# Altium schematic sheet ESP32-S3.SchDoc
size A4; SheetNumber: 2; SheetTotal: 5
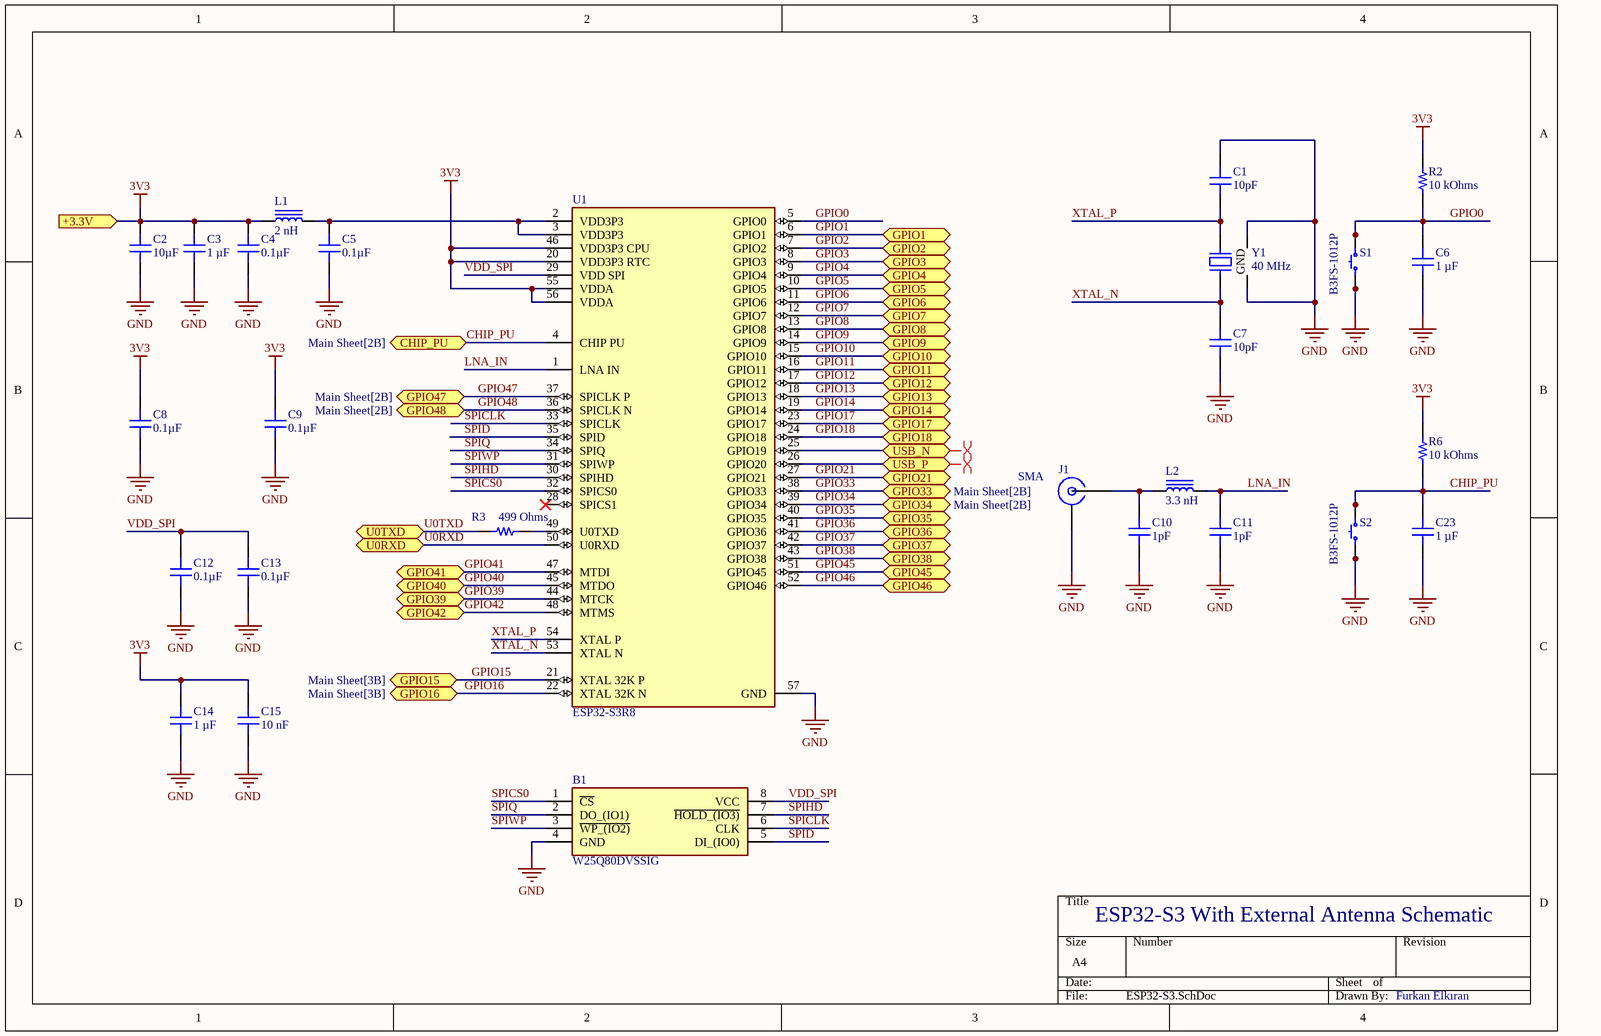
[diagram p0: ESP32-S3.SchDoc]

## Parts
B1  W25Q80DVSSIG  [SOIC127P790X216-8N]
C1  10pF  [CAP 0402_1005]
C2  10µF  [CAP 0402_1005]
C3  1 µF  [CAP 0402_1005]
C4  0.1µF  [CAP 0402_1005]
C5  0.1µF  [CAP 0402_1005]
C6  1 µF  [CAP 0402_1005]
C7  10pF  [CAP 0402_1005]
C8  0.1µF  [CAP 0402_1005]
C9  0.1µF  [CAP 0402_1005]
C10  1pF  [CAP 0402_1005]
C11  1pF  [CAP 0402_1005]
C12  0.1µF  [CAP 0402_1005]
C13  0.1µF  [CAP 0402_1005]
C14  1 µF  [CAP 0402_1005]
C15  Capacitance: 10 nF  [CAP 0402_1005]  (hidden comment: 1 µF)
C23  1 µF  [CAP 0402_1005]
J1  Connector Style: SMA  [MOLEX SD-73100-0114]  (hidden comment: 0731000114)
L1  2 nH  [IND 0402_1005]
L2  3.3 nH  [Murata LQG15 0402]
R2  10 kOhms  [RES 0402_1005]
R3  499 Ohms  [RES 0402_1005]
R6  10 kOhms  [RES 0402_1005]
S1  B3FS-1012P  [OMRON B3FS-1012P]
S2  B3FS-1012P  [OMRON B3FS-1012P]
U1  ESP32-S3R8  [FP-ESP32-S3R8-IPC_A]
Y1  40 MHz  [NDK NX3225SA]

## Ports
+3.3V (in, see Main Sheet[2A], Power[4B], SSD1306[3C]), CHIP_PU (bidir, see Main Sheet[2B]), GPIO1 (bidir, see Main Sheet[3A]), GPIO2 (bidir, see Main Sheet[3A]), GPIO3 (bidir, see Main Sheet[3B]), GPIO4 (bidir, see Main Sheet[3B]), GPIO5 (bidir, see Main Sheet[3B]), GPIO6 (bidir, see Main Sheet[3B]), GPIO7 (bidir, see Main Sheet[3B]), GPIO8 (bidir, see Main Sheet[3B]), GPIO9 (bidir, see Main Sheet[3B]), GPIO10 (bidir, see Main Sheet[3B]), GPIO11 (bidir, see Main Sheet[3B]), GPIO12 (bidir, see Main Sheet[3B]), GPIO13 (bidir, see Main Sheet[3B]), GPIO14 (bidir, see Main Sheet[3B]), GPIO15 (bidir, see Main Sheet[3B]), GPIO16 (bidir, see Main Sheet[3B]), GPIO17 (bidir, see Main Sheet[3B]), GPIO18 (bidir, see Main Sheet[3B]), GPIO21 (bidir, see Main Sheet[3B]), GPIO33 (bidir, see Main Sheet[2B]), GPIO34 (bidir, see Main Sheet[2B]), GPIO35 (bidir, see Main Sheet[2B]), GPIO36 (bidir, see Main Sheet[2B]), GPIO37 (bidir, see Main Sheet[2B]), GPIO38 (bidir, see Main Sheet[2B]), GPIO39 (bidir, see Main Sheet[2B]), GPIO40 (bidir, see Main Sheet[2B]), GPIO41 (bidir, see Main Sheet[2B]), GPIO42 (bidir, see Main Sheet[2B]), GPIO45 (bidir, see Main Sheet[2B]), GPIO46 (bidir, see Main Sheet[2B]), GPIO47 (bidir, see Main Sheet[2B]), GPIO48 (bidir, see Main Sheet[2B]), U0RXD (bidir, see Main Sheet[2B]), U0TXD (bidir, see Main Sheet[2B]), USB_N (bidir, see Main Sheet[2B], USB-C[3B]), USB_P (bidir, see Main Sheet[2B], USB-C[3B])

## Nets
3V3: C2.2 C3.2 C4.2 C8.2 C9.2 C14.2 C15.2 L1.1 R2.2 R6.2 U1.20(VDD3P3_RTC) U1.46(VDD3P3_CPU) U1.55(VDDA) U1.56(VDDA) ; port +3.3V
GND: B1.4(GND) C1.2 C2.1 C3.1 C4.1 C5.1 C6.1 C7.1 C8.1 C9.1 C10.1 C11.1 C12.1 C13.1 C14.1 C15.1 C23.1 J1.G(GND) S1.1 S1.2 S2.1 S2.2 U1.57(GND) Y1.2(GND) Y1.4(GND)
CHIP_PU: C23.2 R6.1 S2.3 S2.4 U1.4(CHIP_PU) ; port CHIP_PU
GPIO0: C6.2 R2.1 S1.3 S1.4 U1.5(GPIO0)
GPIO1: U1.6(GPIO1) ; port GPIO1
GPIO2: U1.7(GPIO2) ; port GPIO2
GPIO3: U1.8(GPIO3) ; port GPIO3
GPIO4: U1.9(GPIO4) ; port GPIO4
GPIO5: U1.10(GPIO5) ; port GPIO5
GPIO6: U1.11(GPIO6) ; port GPIO6
GPIO7: U1.12(GPIO7) ; port GPIO7
GPIO8: U1.13(GPIO8) ; port GPIO8
GPIO9: U1.14(GPIO9) ; port GPIO9
GPIO10: U1.15(GPIO10) ; port GPIO10
GPIO11: U1.16(GPIO11) ; port GPIO11
GPIO12: U1.17(GPIO12) ; port GPIO12
GPIO13: U1.18(GPIO13) ; port GPIO13
GPIO14: U1.19(GPIO14) ; port GPIO14
GPIO15: U1.21(XTAL_32K_P) ; port GPIO15
GPIO16: U1.22(XTAL_32K_N) ; port GPIO16
GPIO17: U1.23(GPIO17) ; port GPIO17
GPIO18: U1.24(GPIO18) ; port GPIO18
GPIO21: U1.27(GPIO21) ; port GPIO21
GPIO33: U1.38(GPIO33) ; port GPIO33
GPIO34: U1.39(GPIO34) ; port GPIO34
GPIO35: U1.40(GPIO35) ; port GPIO35
GPIO36: U1.41(GPIO36) ; port GPIO36
GPIO37: U1.42(GPIO37) ; port GPIO37
GPIO38: U1.43(GPIO38) ; port GPIO38
GPIO39: U1.44(MTCK) ; port GPIO39
GPIO40: U1.45(MTDO) ; port GPIO40
GPIO41: U1.47(MTDI) ; port GPIO41
GPIO42: U1.48(MTMS) ; port GPIO42
GPIO45: U1.51(GPIO45) ; port GPIO45
GPIO46: U1.52(GPIO46) ; port GPIO46
GPIO47: U1.37(SPICLK_P) ; port GPIO47
GPIO48: U1.36(SPICLK_N) ; port GPIO48
LNA_IN: C11.2 L2.2 U1.1(LNA_IN)
SPICLK: B1.6(CLK) U1.33(SPICLK)
SPICS0: B1.1(~{CS}) U1.32(SPICS0)
SPID: B1.5(DI_(IO0)) U1.35(SPID)
SPIHD: B1.7(~{HOLD_(IO3)}) U1.30(SPIHD)
SPIQ: B1.2(DO_(IO1)) U1.34(SPIQ)
SPIWP: B1.3(~{WP_(IO2)}) U1.31(SPIWP)
U0RXD: U1.50(U0RXD) ; port U0RXD
U0TXD: R3.1 ; port U0TXD
USB_N: U1.25(GPIO19) ; port USB_N
USB_P: U1.26(GPIO20) ; port USB_P
VDD_SPI: B1.8(VCC) C12.2 C13.2 U1.29(VDD_SPI)
XTAL_N: C7.2 U1.53(XTAL_N) Y1.1
XTAL_P: C1.1 U1.54(XTAL_P) Y1.3
NetC5_2: C5.2 L1.2 U1.2(VDD3P3) U1.3(VDD3P3)
NetC10_2: C10.2 J1.S(SIGNAL) L2.1
NetR3_2: R3.2 U1.49(U0TXD)

Not connected (* = marked no-connect by the designer): U1 28(SPICS1)*

## Layout directives
differential pair: USB_N, USB_P

## Notes on the sheet
- ESP32-S3 With External Antenna Schematic
- Furkan Elkıran

## Library data of the parts
B1 = W25Q80DVSSIG: 8Mb Serial NOR Flash 104MHz SOP8; Manufacturer_Name: Winbond; Geometry.Height: 2.16mm; Manufacturer_Part_Number: W25Q80DVSSIG; Mouser Part Number: 454-W25Q80DVSSIG; Mouser Price/Stock: https://www.mouser.co.uk/ProductDetail/Winbond/W25Q80DVSSIG?qs=qSfuJ%252Bfl%2Fd6z%2FQYNv5lpMA%3D%3D; Arrow Part Number: W25Q80DVSSIG; Arrow Price/Stock: https://www.arrow.com/en/products/w25q80dvssig/winbond-electronics?region=nac; Datasheet Link: https://www.winbond.com/hq/search-resource-file.jsp?partNo=W25Q80DVSSIG&type=datasheet
C1 C7 = 0402YA100KAT2A: CAP CER 10PF 16V NP0 0402; manufacturer: AVX Corporation; Temperature Coefficient: C0G, NP0; Tolerance: ±10%; Part Number: 0402YA100KAT2A; Capacitance: 10pF; Applications: General Purpose; componentlink1description: Datasheet; componentlink1url: http://datasheets.avx.com/C0GNP0-Dielectric.pdf; componentlink2description: DigiKey Link; componentlink2url: http://digikey.com/product-detail/en/avx-corporation/0402YA100KAT2A/478-12649-1-ND/9949182; Device Package: 0402 (1005 Metric); lastupdated: 8.02.2022 12:26:50; Lifecycle Status: Active; Minimum Order: 1; Mounting Type: Surface Mount, MLCC; Operating Temperature: -55°C ~ 125°C; Package / Case: 0402 (1005 Metric); packaging: TapeAndReel; partid: 7279; Part Status: Active; price: 0.01; series: -; Size / Dimension: 0.039" L x 0.020" W (1.00mm x 0.50mm); Supplier 1: DigiKey; Supplier Part Number 1: 478-12649-1-ND; Thickness (Max): 0.022" (0.56mm); value: 10pF; Voltage - Rated: 16V
C2 = 0402ZD106MAT2A: CAP CER 10UF 10V X5R 0402; manufacturer: AVX Corporation; Tolerance: ±20%; Part Number: 0402ZD106MAT2A; Capacitance: 10µF; Applications: General Purpose; componentlink1description: Datasheet; componentlink1url: http://datasheets.avx.com/cx5r.pdf; componentlink2description: DigiKey Link; componentlink2url: http://digikey.com/product-detail/en/avx-corporation/0402ZD106MAT2A/478-10052-1-ND/6564275; Device Package: 0402 (1005 Metric); lastupdated: 8.02.2022 12:26:50; Lifecycle Status: Active; Minimum Order: 1; Mounting Type: Surface Mount, MLCC; Operating Temperature: -55°C ~ 85°C; Package / Case: 0402 (1005 Metric); packaging: TapeAndReel; partid: 6854; Part Status: Active; price: 0.24; series: -; Size / Dimension: 0.039" L x 0.020" W (1.00mm x 0.50mm); Supplier 1: DigiKey; Supplier Part Number 1: 478-10052-1-ND; Temperature Coefficient: X5R; Thickness (Max): 0.028" (0.71mm); value: 10µF; Voltage - Rated: 10V
C3 C6 C14 C15 C23 = GMC04X7R105K10NT: CAP0402 X7R 1UF 10% 10V; manufacturer: Cal-Chip Electronics, Inc.; Part Number: GMC04X7R105K10NT; Applications: General Purpose; componentlink1description: Datasheet; componentlink1url: https://88ce57.p3cdn1.secureserver.net/wp-content/uploads/2023/01/gmc_series-2.pdf; componentlink2description: DigiKey Link; componentlink2url: https://www.digikey.com/en/products/detail/cal-chip-electronics-inc/GMC04X7R105K10NT/18151137; Device Package: 0402 (1005 Metric); lastupdated: 9.02.2024 20:03:57; Lifecycle Status: Active; Minimum Order: 1; Mounting Type: Surface Mount, MLCC; Operating Temperature: -55°C ~ 125°C; Package / Case: 0402 (1005 Metric); packaging: TapeAndReel; partid: 49948; Part Status: Active; price: 0.02; series: GMC; Size / Dimension: 0.039" L x 0.020" W (1.00mm x 0.50mm); Supplier 1: DigiKey; Supplier Part Number 1: 4713-GMC04X7R105K10NTCT-ND; Temperature Coefficient: X7R; Thickness (Max): 0.022" (0.55mm); Tolerance: ±10%; value: 1 µF; Voltage - Rated: 10V
  C3 C6 C14 C23: Capacitance: 1 µF
C4 C5 C8 C9 C12 C13 = 0402YD104JAT2A: CAP CER 0.1UF 16V X5R 0402; manufacturer: AVX Corporation; Tolerance: ±5%; Part Number: 0402YD104JAT2A; Capacitance: 0.1µF; Applications: General Purpose; componentlink1description: Datasheet; componentlink1url: http://datasheets.avx.com/cx5r.pdf; componentlink2description: DigiKey Link; componentlink2url: http://digikey.com/product-detail/en/avx-corporation/0402YD104JAT2A/478-11505-1-ND/8107706; Device Package: 0402 (1005 Metric); lastupdated: 8.02.2022 12:26:42; Lifecycle Status: Active; Minimum Order: 1; Mounting Type: Surface Mount, MLCC; Operating Temperature: -55°C ~ 85°C; Package / Case: 0402 (1005 Metric); packaging: TapeAndReel; partid: 11013; Part Status: Active; price: 0.15; series: -; Size / Dimension: 0.039" L x 0.020" W (1.00mm x 0.50mm); Supplier 1: DigiKey; Supplier Part Number 1: 478-11505-1-ND; Temperature Coefficient: X5R; Thickness (Max): 0.022" (0.56mm); value: 0.1µF; Voltage - Rated: 16V
C10 C11 = 04023A1R0BAT2A: CAP CER 1PF 25V NP0 0402; manufacturer: AVX Corporation; Temperature Coefficient: C0G, NP0; Tolerance: ±0.1pF; Part Number: 04023A1R0BAT2A; Capacitance: 1pF; Applications: General Purpose; componentlink1description: Datasheet; componentlink1url: http://datasheets.avx.com/C0GNP0-Dielectric.pdf; componentlink2description: DigiKey Link; componentlink2url: http://digikey.com/product-detail/en/avx-corporation/04023A1R0BAT2A/478-11739-1-ND/8573375; Device Package: 0402 (1005 Metric); lastupdated: 8.02.2022 12:26:50; Lifecycle Status: Active; Minimum Order: 1; Mounting Type: Surface Mount, MLCC; Operating Temperature: -55°C ~ 125°C; Package / Case: 0402 (1005 Metric); packaging: TapeAndReel; partid: 7016; Part Status: Active; price: 0.06; series: -; Size / Dimension: 0.039" L x 0.020" W (1.00mm x 0.50mm); Supplier 1: DigiKey; Supplier Part Number 1: 478-11739-1-ND; Thickness (Max): 0.022" (0.56mm); value: 1pF; Voltage - Rated: 25V
J1 = 0731000114: CONN SMA RCPT R/A 50 OHM PCB; Manufacturer: Molex; Connector Type: Receptacle, Female Socket; Contact Termination: Solder; Frequency - Max: 18 GHz; Impedance: 50Ohm; Number of Ports: 1; Part Number: 0731000114; ComponentLink1Description: Datasheet; ComponentLink1URL: https://www.molex.com/pdm_docs/sd/731000114_sd.pdf; ComponentLink2Description: DigiKey Link; ComponentLink2URL: https://www.digikey.com/en/products/detail/molex/0731000114/1465147; Fastening Type: Threaded; Housing Color: Gold; LastUpdated: 29.06.2022 18:00:24; Lifecycle Status: Active; Minimum Order: 1; Mounting Type: Through Hole, Right Angle; Packaging: Tray; Part Status: Active; Price: 3.19; Series: 73100; Shield Termination: Solder; Supplier 1: DigiKey; Supplier Part Number 1: WM5525-ND
L1 = MHQ1005075HA2N0STD25: FIXED IND 2.0NH 1A 50 MOHM SMD; Manufacturer: TDK Corporation; DC Resistance (DCR): 50mOhm Max; Frequency - Self Resonant: 8GHz; Inductance Frequency - Test: 100 MHz; Material - Core: Ceramic; Q @ Freq: 20 @ 250MHz; Shielding: Unshielded; Tolerance: ±0.3nH; Type: Multilayer; Part Number: MHQ1005075HA2N0STD25; ComponentLink1Description: Datasheet; ComponentLink1URL: https://product.tdk.com/system/files/dam/doc/product/inductor/inductor/smd/catalog/inductor_automotive_high-frequency_mhq1005075ha_en.pdf; ComponentLink2Description: DigiKey Link; ComponentLink2URL: https://www.digikey.com/en/products/detail/tdk-corporation/MHQ1005075HA2N0STD25/21727258; Current Rating (Amps): 1 A; Device Package: 0402 (1005 Metric); Height - Seated (Max): 0.030" (0.75mm); Inductance: 2 nH; LastUpdated: 3.06.2024 20:12:06; Lifecycle Status: Active; Minimum Order: 1; Mounting Type: Surface Mount; Operating Temperature: -55°C ~ 125°C; Package / Case: 0402 (1005 Metric); Packaging: TapeAndReel; PartId: 7450; Price: 0.07; Ratings: AEC-Q200; Series: MHQ; Size / Dimension: 0.039" L x 0.020" W (1.00mm x 0.50mm); Supplier 1: DigiKey; Supplier Part Number 1: 445-MHQ1005075HA2N0STD25CT-ND; Supplier Device Package: 0402; Value: 2 nH
L2 = LQG15HH3N3C02D: FIXED IND 3.3NH 800MA 0.125OHM; Manufacturer: Murata Electronics; DC Resistance (DCR): 125mOhm Max; Frequency - Self Resonant: 6GHz; Inductance Frequency - Test: 100 MHz; Material - Core: Air; Q @ Freq: 8 @ 100MHz; Shielding: Unshielded; Tolerance: ±0.2nH; Type: Multilayer; Part Number: LQG15HH3N3C02D; ComponentLink1Description: Datasheet; ComponentLink1URL: https://search.murata.co.jp/Ceramy/image/img/P02/JELF243B-9101.pdf; ComponentLink2Description: DigiKey Link; ComponentLink2URL: https://www.digikey.com/en/products/detail/murata-electronics/LQG15HH3N3C02D/6798466; Current Rating (Amps): 800 mA; Device Package: 0402 (1005 Metric); Height - Seated (Max): 0.022" (0.55mm); Inductance: 3.3 nH; LastUpdated: 19.07.2024 23:59:52; Lifecycle Status: Active; Minimum Order: 1; Mounting Type: Surface Mount; Operating Temperature: -55°C ~ 125°C; Package / Case: 0402 (1005 Metric); Packaging: TapeAndReel; PartId: 2999; Part Status: Active; Price: 0.05; Ratings: AEC-Q200; Series: LQG15; Size / Dimension: 0.039" L x 0.020" W (1.00mm x 0.50mm); Supplier 1: DigiKey; Supplier Part Number 1: 490-15041-1-ND; Supplier Device Package: 0402 (1005 Metric); Value: 3.3 nH
R2 R6 = MCS0402MC1002FE000: RES SMD 10K OHM 1% 1/10W 0402; Manufacturer: Vishay Beyschlag; Power (Watts): 0.1W, 1/10W; Temperature Coefficient: ±50ppm/°C; Part Number: MCS0402MC1002FE000; Value: 10 kOhms; ComponentLink1Description: Datasheet; ComponentLink1URL: http://www.vishay.com/docs/28760/mcat_pro.pdf; ComponentLink2Description: DigiKey Link; ComponentLink2URL: http://digikey.com/product-detail/en/vishay-beyschlag/MCS0402MC1002FE000/MCS0402-10.0K-MFCT-ND/3883092; Composition: Thin Film; Device Package: 0402 (1005 Metric); Features: Anti-Sulfur, Automotive AEC-Q200; Height - Seated (Max): 0.015" (0.37mm); LastUpdated: 9.02.2024 20:30:21; Lifecycle Status: Active; Minimum Order: 1; Number of Terminations: 2; Operating Temperature: -55°C ~ 175°C; Package / Case: 0402 (1005 Metric); Packaging: TapeAndReel; PartId: 3152; Part Status: Active; Price: 0.03; Ratings: AEC-Q200; Resistance: 10 kOhms; Series: MCS AT - Professional; Size / Dimension: 0.039" L x 0.020" W (1.00mm x 0.50mm); Supplier 1: DigiKey; Supplier Part Number 1: MCS0402-10.0K-MFCT-ND; Supplier Device Package: 0402; Tolerance: ±1%
R3 = RMCF0402FT499R: RES 499 OHM 1% 1/16W 0402; Manufacturer: Stackpole Electronics Inc; Power (Watts): 0.063W, 1/16W; Temperature Coefficient: ±100ppm/°C; Part Number: RMCF0402FT499R; Value: 499 Ohms; ComponentLink1Description: Datasheet; ComponentLink1URL: https://www.seielect.com/catalog/sei-rmcf_rmcp.pdf; ComponentLink2Description: DigiKey Link; ComponentLink2URL: https://www.digikey.com/en/products/detail/stackpole-electronics-inc/RMCF0402FT499R/1714756; Composition: Thick Film; Device Package: 0402 (1005 Metric); Features: Automotive AEC-Q200; Height - Seated (Max): 0.016" (0.40mm); LastUpdated: 9.02.2024 20:30:13; Lifecycle Status: Active; Minimum Order: 1; Number of Terminations: 2; Operating Temperature: -55°C ~ 155°C; Package / Case: 0402 (1005 Metric); Packaging: CutTape; PartId: 4940; Part Status: Active; Price: 0.01; Ratings: AEC-Q200; Resistance: 499 Ohms; Series: RMCF; Size / Dimension: 0.039" L x 0.020" W (1.00mm x 0.50mm); Supplier 1: DigiKey; Supplier Part Number 1: RMCF0402FT499RCT-ND; Supplier Device Package: 0402; Tolerance: ±1%
S1 S2 = B3FS-1012P: SWITCH TACTILE SPST-NO 0.05A 24V; Manufacturer: Omron Electronics Inc-EMC Div; Actuator Height off PCB, Vertical: 4.30mm; Actuator Orientation: Top Actuated; Actuator Type: Standard; Contact Rating @ Voltage: 0.05A @ 24VDC; Illumination: Non-Illuminated; Operating Force: 150gf; Outline: 6.30mm x 6.00mm; Switch Function: Off-Mom; Part Number: B3FS-1012P; Circuit: SPST-NO; ComponentLink1Description: Datasheet; ComponentLink1URL: https://omronfs.omron.com/en_US/ecb/products/pdf/en-b3fs.pdf; ComponentLink2Description: DigiKey Link; ComponentLink2URL: http://digikey.com/product-detail/en/omron-electronics-inc-emc-div/B3FS-1012P/SW1237CT-ND/2747253; LastUpdated: 30.03.2020 15:12:46; Lifecycle Status: Active; Minimum Order: 1; Mounting Type: Surface Mount; Operating Temperature: -25°C ~ 70°C; Packaging: TapeAndReel; Part Status: Active; Price: 0.35; Series: B3FS; Supplier 1: DigiKey; Supplier Part Number 1: SW1237CT-ND; Termination Style: Gull Wing
U1 = CMP-10700-118292493-1: ESP32-S3R8 RF System on a Chip - SoC SMD IC, Dual-Core MCU, Wi-Fi 2.4G BLE 5.0 Combo; NexarPartId: 118292493
Y1 = NX3225SA-40M-EXS00A-CS03880: CRYSTAL 40.0000MHZ 10PF SMD; Manufacturer: NDK America, Inc.; ESR (Equivalent Series Resistance): 50 Ohms; Frequency Stability: ±17ppm; Frequency Tolerance: ±10ppm; Operating Mode: Fundamental; Part Number: NX3225SA-40M-EXS00A-CS03880; ComponentLink1Description: Datasheet; ComponentLink1URL: //media.digikey.com/pdf/Data%20Sheets/NDK%20PDFs/NX3225SA-40M-EXS00A-CS03880.pdf; ComponentLink2Description: DigiKey Link; ComponentLink2URL: https://www.digikey.com/en/products/detail/ndk-america-inc/NX3225SA-40M-EXS00A-CS03880/5015625; Frequency: 40 MHz; Height - Seated (Max): 0.024" (0.60mm); LastUpdated: 3.06.2024 20:02:21; Lifecycle Status: Active; Load Capacitance: 10pF; Minimum Order: 1; Mounting Type: Surface Mount; Operating Temperature: -40°C ~ 85°C; Package / Case: 4-SMD, No Lead; Packaging: TapeAndReel; PartId: 586; Part Status: Active; Price: 0.36; Series: NX3225SA; Size / Dimension: 0.126" L x 0.098" W (3.20mm x 2.50mm); Supplier 1: DigiKey; Supplier Part Number 1: 644-1249-1-ND; Type: MHz Crystal; Value: 40 MHz